# Altium schematic sheet mcu.SchDoc
size A
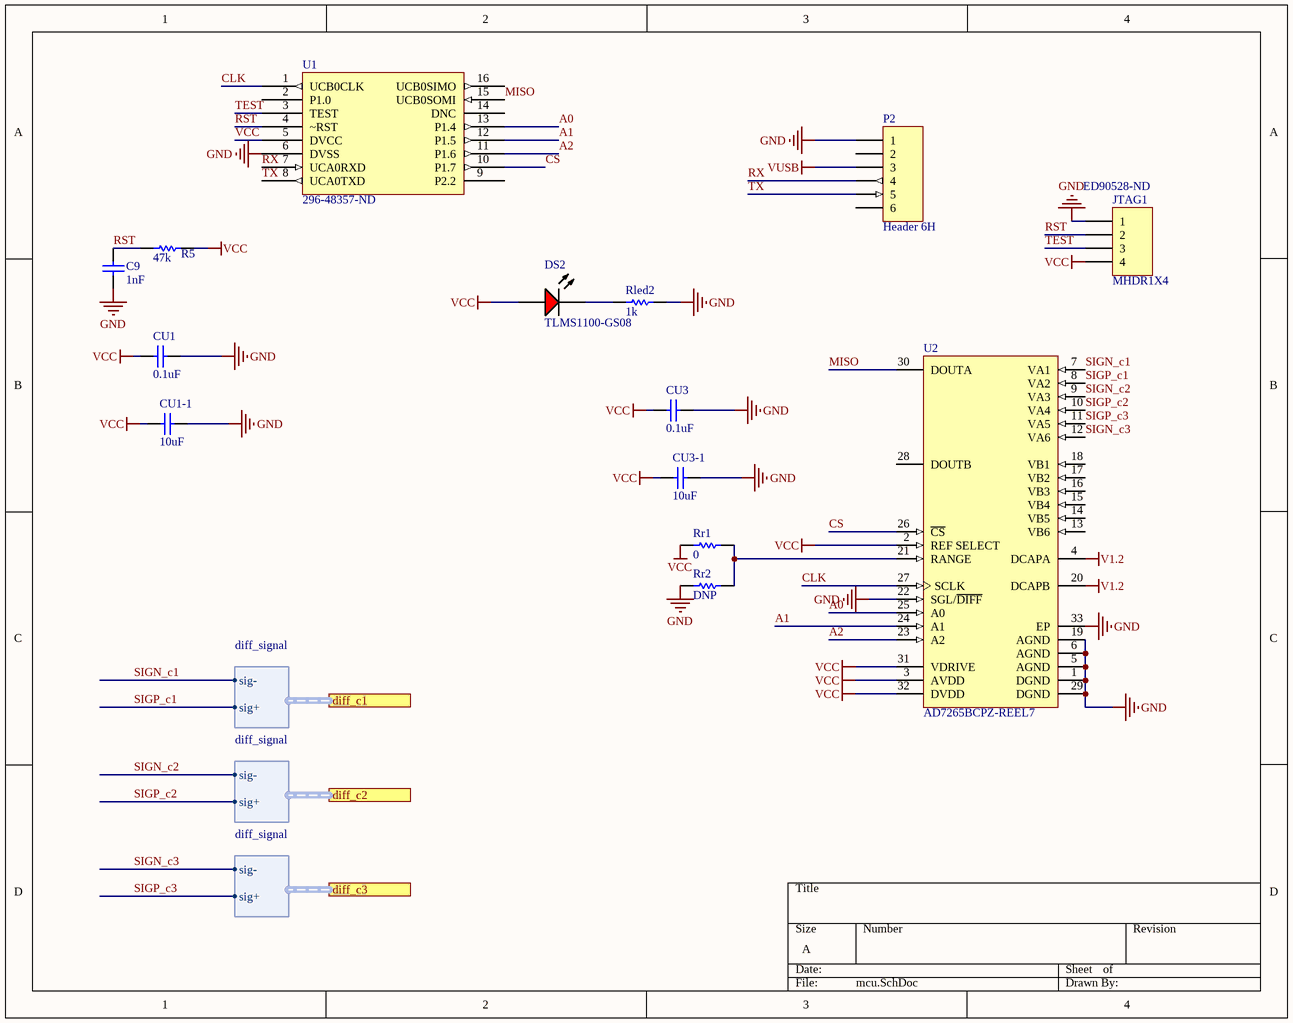
[diagram p0: mcu.SchDoc]

## Parts
C9  value 1nF  [0402]  (hidden comment: Cap)
CU1  value 0.1uF  [0402]  (hidden comment: Cap)
CU1-1  value 10uF  [0402]  (hidden comment: Cap)
CU3  value 0.1uF  [0402]  (hidden comment: Cap)
CU3-1  value 10uF  [0402]  (hidden comment: Cap)
DS2  TLMS1100-GS08  [VISH-TLMX1100_V]
JTAG1  MHDR1X4  Supplier Part Number 1: ED90528-ND  [MHDR1X4]
P2  Header 6H  [HDR1X6H]
R5  value 47k  [0402]  (hidden comment: Res)
Rled2  value 1k  [0402]  (hidden comment: Res)
Rr1  value 0  [0402]  (hidden comment: Res)
Rr2  value DNP  [0402]  (hidden comment: Res)
U1  Supplier Part Number 1: 296-48357-ND  [TSOP65P640X120-16N]  (hidden comment: MSP430FR2422)
U2  AD7265BCPZ-REEL7  [CP-32-2_M]

## Ports
diff_c1 (harness diff_signal), diff_c2 (harness diff_signal), diff_c3 (harness diff_signal)

## Harnesses
diff_signal: sig+, sig-

## Nets
GND: C9.1 CU1.1 CU1-1.1 CU3.1 CU3-1.1 JTAG1.1 P2.1 Rled2.2 Rr2.1 U1.6(DVSS) U2.1(DGND) U2.5(AGND) U2.6(AGND) U2.19(AGND) U2.22(SGL/~{DIFF}) U2.29(DGND) U2.33(EP)
V1.2: U2.4(DCAPA) U2.20(DCAPB)
VCC: CU1.2 CU1-1.2 CU3.2 CU3-1.2 DS2.1(A) JTAG1.4 R5.2 Rr1.1 U1.5(DVCC) U2.2(REF_SELECT) U2.3(AVDD) U2.31(VDRIVE) U2.32(DVDD)
VUSB: P2.3
A0: U1.13(P1.4) U2.25(A0)
A1: U1.12(P1.5) U2.24(A1)
A2: U1.11(P1.6) U2.23(A2)
CLK: U1.1(UCB0CLK) U2.27(SCLK)
CS: U1.10(P1.7) U2.26(~{CS})
MISO: U1.15(UCB0SOMI) U2.30(DOUTA)
RST: C9.2 JTAG1.2 R5.1 U1.4(~RST)
RX: P2.4 U1.7(UCA0RXD)
SIGN_c1: U2.7(VA1) ; port diff_c1.sig-
SIGN_c2: U2.9(VA3) ; port diff_c2.sig-
SIGN_c3: U2.12(VA6) ; port diff_c3.sig-
SIGP_c1: U2.8(VA2) ; port diff_c1.sig+
SIGP_c2: U2.10(VA4) ; port diff_c2.sig+
SIGP_c3: U2.11(VA5) ; port diff_c3.sig+
TEST: JTAG1.3 U1.3(TEST)
TX: P2.5 U1.8(UCA0TXD)
NetDS2_2: DS2.2(K) Rled2.1
NetRr1_2: Rr1.2 Rr2.2 U2.21(RANGE)

Not connected (* = marked no-connect by the designer): P2 2 6; U1 2(P1.0) 9(P2.2) 14(DNC) 16(UCB0SIMO); U2 13(VB6) 14(VB5) 15(VB4) 16(VB3) 17(VB2) 18(VB1) 28(DOUTB)

## Library data of the parts
C9 CU1 CU1-1 CU3 CU3-1 = Cap: Ceramic Capacitor (Surface Mount); Manufacturer: Generic Ceramic Chip Cap (TBD); Digi-Key Part Number: *; Manufacturer Part Number: *; Note: *; Rating: *
DS2 = CMP-1666-00027-1: LED, RED, 2.1 V, -40 to 100 degC, 2-Pin SMD (0603), RoHS, Tape and Reel; Type (Capacitors): C0G; Resistance: 100000000000 Ohm; Capacitance: 12 pF; Voltage Rating: 50 V; Tolerance: 5%; Min Operating Temperature: -55degC; REACH SVHC: No SVHC; ComponentLink2Description: Datasheet; ComponentLink1URL: http://www.vishay.com/; Width: 0.8 mm; Package Quantity: 4000; PackageReference: TLMX1100; ComponentLink2URL: http://www.vishay.com/docs/83173/tlmb1100.pdf; Case/Package: 0603; Case Code (Metric): 1608; Packaging: Tape and Reel; Pins: 2; ComponentLink1Description: Manufacturer URL; Max Operating Temperature: 125degC; Height: 0.8 mm; Length: 1.6 mm; Mount: Surface Mount; PackageDescription: 2-Pin Surface Mount Device, Body 1.6 x 0.8 mm; DatasheetVersion: Rev. 2.7, 03/2016; Case Code (Imperial): 0603; Voltage Rating (DC): 50 V; RoHSCompliant: True; Radiation Hardening: No
JTAG1 = MHDR1X4: Header, 4-Pin; LatestRevisionDate: 17-Jul-2002; LatestRevisionNote: Re-released for DXP Platform.; Publisher: Altium Limited; Supplier 1: Digi-Key
P2 = Header 6H: Header, 6-Pin, Right Angle; LatestRevisionDate: 17-Jul-2002; LatestRevisionNote: Re-released for DXP Platform.; Publisher: Altium Limited
R5 Rled2 Rr1 Rr2 = Res: Chip Resistor (Surface Mount); Manufacturer: Generic Chip Res (TBD); Manufacturer Part Number: *; Digi-Key Part Number: *; Rating: *
U1 = MSP430FR2422: MSP430FR2422 Mixed-Signal Microcontroller; Supplier 1: Digi-Key
U2 = CMP-0313-00283-2: 1Dual 12-Bit SAR Analog-to-Digital Converter with Serial, SPI Interface, 1MSPS, -40 to +125 degC, CP-32-2, Pb-Free, Reel; Generic Part Number: AD7265; Manufacturer: Analog Devices; Interface: Ser, SPI; Throughput Rate (SPS): 1M; Resolution (Bits): 12; DatasheetVersion: Rev.A; Packing: Reel; ComponentLink1Description: Manufacturer URL; RoHS: Y; ComponentLink2Description: Datasheet; ComponentLink4URL: http://www.analog.com/en/analog-to-digital-converters/ad-converters/ad7265/products/product.html; Channels: 12; ComponentLink1URL: http://www.analog.com/en/index.html; PackageVersion: Jan-2005; ComponentLink4Description: Product URL; ComponentLink3Description: Package Specification; ComponentLink3URL: http://www.analog.com/static/imported-files/packages/414143737956480539664569CP_32_2.pdf; PackageDescription: 32-Lead Lead Frame Chip Scale Package [LFCSP_VQ] 5 x 5 mm Body, Very Thin Quad; Code_JEDEC: MO-220-VHHD-2; PackageReference: CP-32-2; PartNumber: AD7265BCPZ-REEL7; ComponentLink2URL: http://www.analog.com/static/imported-files/data_sheets/AD7265.pdf; Mounting Technology: Surface Mount